# EAGLE design CktoControl (EAGLE 5.11)
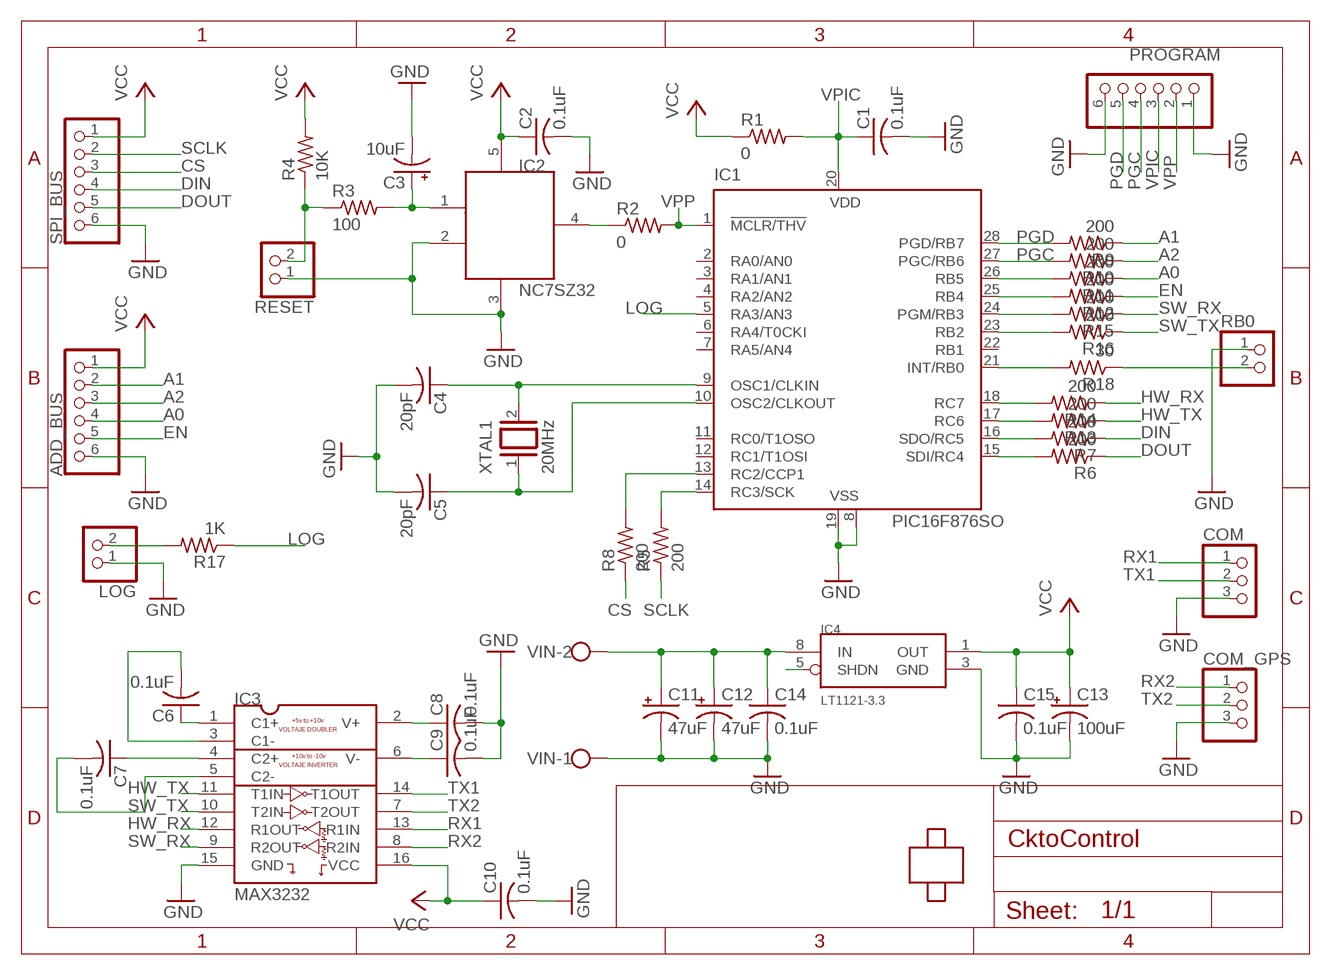
[diagram p0: schematic, sheet 1]

## Parts
ADD_BUS  PINHD-1X6  [1X06]
C1  0.1uF  C-USC0603  [C0603]
C2  0.1uF  C-USC0603  [C0603]
C3  10uF  CPOL-USA/3216-18W  [A/3216-18W]
C4  20pF  C-USC0603  [C0603]
C5  20pF  C-USC0603  [C0603]
C6  0.1uF  C-USC0603  [C0603]
C7  0.1uF  C-USC0603  [C0603]
C8  0.1uF  C-USC0603  [C0603]
C9  0.1uF  C-USC0603  [C0603]
C10  0.1uF  C-USC0603  [C0603]
C11  47uF  CPOL-USE  [PANASONIC_E]
C12  47uF  CPOL-USE  [PANASONIC_E]
C13  100uF  CPOL-USE  [PANASONIC_E]
C14  0.1uF  C-USC0603  [C0603]
C15  0.1uF  C-USC0603  [C0603]
COM  PINHD-1X3/90  [1X03/90]
COM_GPS  PINHD-1X3/90  [1X03/90]
IC1  PIC16F876SO  [SO28W]
IC2  NC7SZ32  NC7S32  [SOT-23-5]
IC3  MAX3232  [SOIC16N]
IC4  LT1121-3.3  [SO08]
LOG  PINHD-1X2/90  [1X02/90]
PROGRAM  PINHD-1X6/90  [1X06/90]
R1  0  R-US_R0603  [R0603]
R2  0  R-US_R0603  [R0603]
R3  100  R-US_R0603  [R0603]
R4  10K  R-US_R0603  [R0603]
R5  200  R-US_R0603  [R0603]
R6  200  R-US_R0603  [R0603]
R7  200  R-US_R0603  [R0603]
R8  200  R-US_R0603  [R0603]
R9  200  R-US_R0603  [R0603]
R10  200  R-US_R0603  [R0603]
R11  200  R-US_R0603  [R0603]
R12  200  R-US_R0603  [R0603]
R13  200  R-US_R0603  [R0603]
R14  200  R-US_R0603  [R0603]
R15  200  R-US_R0603  [R0603]
R16  200  R-US_R0603  [R0603]
R17  1K  R-US_R0603  [R0603]
R18  30  R-US_R0603  [R0603]
RB0  PINHD-1X2  [1X02]
RESET  PINHD-1X2/90  [1X02/90]
SPI_BUS  PINHD-1X6  [1X06]
U$1  BOARD_ADC  [BOARD_ADC]
VIN  W237-102  [W237-102]
XTAL1  20MHz  XTAL  [XTAL]

## Nets
A0: ADD_BUS.4 R11.1
A1: ADD_BUS.2 R9.1
A2: ADD_BUS.3 R10.1
CS: R8.1 SPI_BUS.3
DIN: R7.1 SPI_BUS.4
DOUT: R6.1 SPI_BUS.5
EN: ADD_BUS.5 R12.1
GND: ADD_BUS.6 C1.2 C2.2 C3.- C4.2 C5.2 C8.2 C9.2 C10.2 C11.- C12.- C13.- C14.2 C15.2 COM.3 COM_GPS.3 IC1.8(VSS) IC1.19(VSS) IC2.2(IN2) IC2.3(1_GND) IC3.15(GND) IC4.3(GND) LOG.1 PROGRAM.1 PROGRAM.6 RB0.1 RESET.1 SPI_BUS.6 VIN.1
HW_RX: IC3.12(R1OUT) R14.1
HW_TX: IC3.11(T1IN) R13.1
LOG: IC1.5(RA3/AN3) R17.1
N$5: IC2.4(OUT) R2.1
N$6: C5.1 IC1.10(OSC2/CLKOUT) XTAL1.1
N$7: C3.+ IC2.1(IN1) R3.2
N$8: R3.1 R4.1 RESET.2
N$9: C4.1 IC1.9(OSC1/CLKIN) XTAL1.2
N$10: C6.1 IC3.1(C1+)
N$11: C6.2 IC3.3(C1-)
N$12: C7.1 IC3.4(C2+)
N$13: C7.2 IC3.5(C2-)
N$14: C8.1 IC3.2(V+)
N$15: C9.1 IC3.6(V-)
N$16: IC1.13(RC2/CCP1) R8.2
N$17: IC1.24(PGM/RB3) R15.2
N$18: IC1.14(RC3/SCK) R5.2
N$19: IC1.15(SDI/RC4) R6.2
N$20: IC1.16(SDO/RC5) R7.2
N$21: IC1.23(RB2) R16.2
N$22: IC1.26(RB5) R11.2
N$23: IC1.25(RB4) R12.2
N$24: IC1.18(RC7) R14.2
N$25: IC1.17(RC6) R13.2
N$26: LOG.2 R17.2
N$27: C11.+ C12.+ C14.1 IC4.8(IN) VIN.2
N$28: IC1.21(INT/RB0) R18.2
N$29: R18.1 RB0.2
N$31: IC4.5(SHDN)
PGC: IC1.27(PGC/RB6) PROGRAM.4 R10.2
PGD: IC1.28(PGD/RB7) PROGRAM.5 R9.2
RX1: COM.1 IC3.13(R1IN)
RX2: COM_GPS.1 IC3.8(R2IN)
SCLK: R5.1 SPI_BUS.2
SW_RX: IC3.9(R2OUT) R15.1
SW_TX: IC3.10(T2IN) R16.1
TX1: COM.2 IC3.14(T1OUT)
TX2: COM_GPS.2 IC3.7(T2OUT)
VCC: ADD_BUS.1 C2.1 C10.1 C13.+ C15.1 IC2.5(1_VCC) IC3.16(VCC) IC4.1(OUT) R1.1 R4.2 SPI_BUS.1
VPIC: C1.1 IC1.20(VDD) PROGRAM.3 R1.2
VPP: IC1.1(!MCLR/THV) PROGRAM.2 R2.2
Unconnected: IC1.2(RA0/AN0) IC1.3(RA1/AN1) IC1.4(RA2/AN2) IC1.6(RA4/T0CKI) IC1.7(RA5/AN4) IC1.11(RC0/T1OSO) IC1.12(RC1/T1OSI) IC1.22(RB1)

## Library data of the parts
ADD_BUS PROGRAM SPI_BUS = pinhead:PINHD-1X6: PIN HEADER
C1 C2 C4-C10 C14 C15 = rcl:C-US: CAPACITOR, American symbol
C3 C11-C13 = rcl:CPOL-US: POLARIZED CAPACITOR, American symbol
COM COM_GPS = pinhead:PINHD-1X3: PIN HEADER
IC1 = microchip:PIC16*876: MICROCONTROLLER flash type; MF: MICROCHIP; MPN: PIC16F876-20/SO; OC_FARNELL: 9761268; OC_NEWARK: 12C1950
IC2 = magnetometro:NC7S32
IC3 = Ricardo_Library:MAX3232
IC4 = Ricardo_Library:LT1121-3.3
LOG RB0 RESET = pinhead:PINHD-1X2: PIN HEADER
R1-R18 = rcl:R-US_: RESISTOR, American symbol
U$1 = magnetometro:BOARD_ADC
VIN = con-wago-500:W237-102: WAGO SCREW CLAMP; MPN: 237-102; OC_FARNELL: unknown; OC_NEWARK: 70K9898
XTAL1 = Ricardo_Library:XTAL

## Board
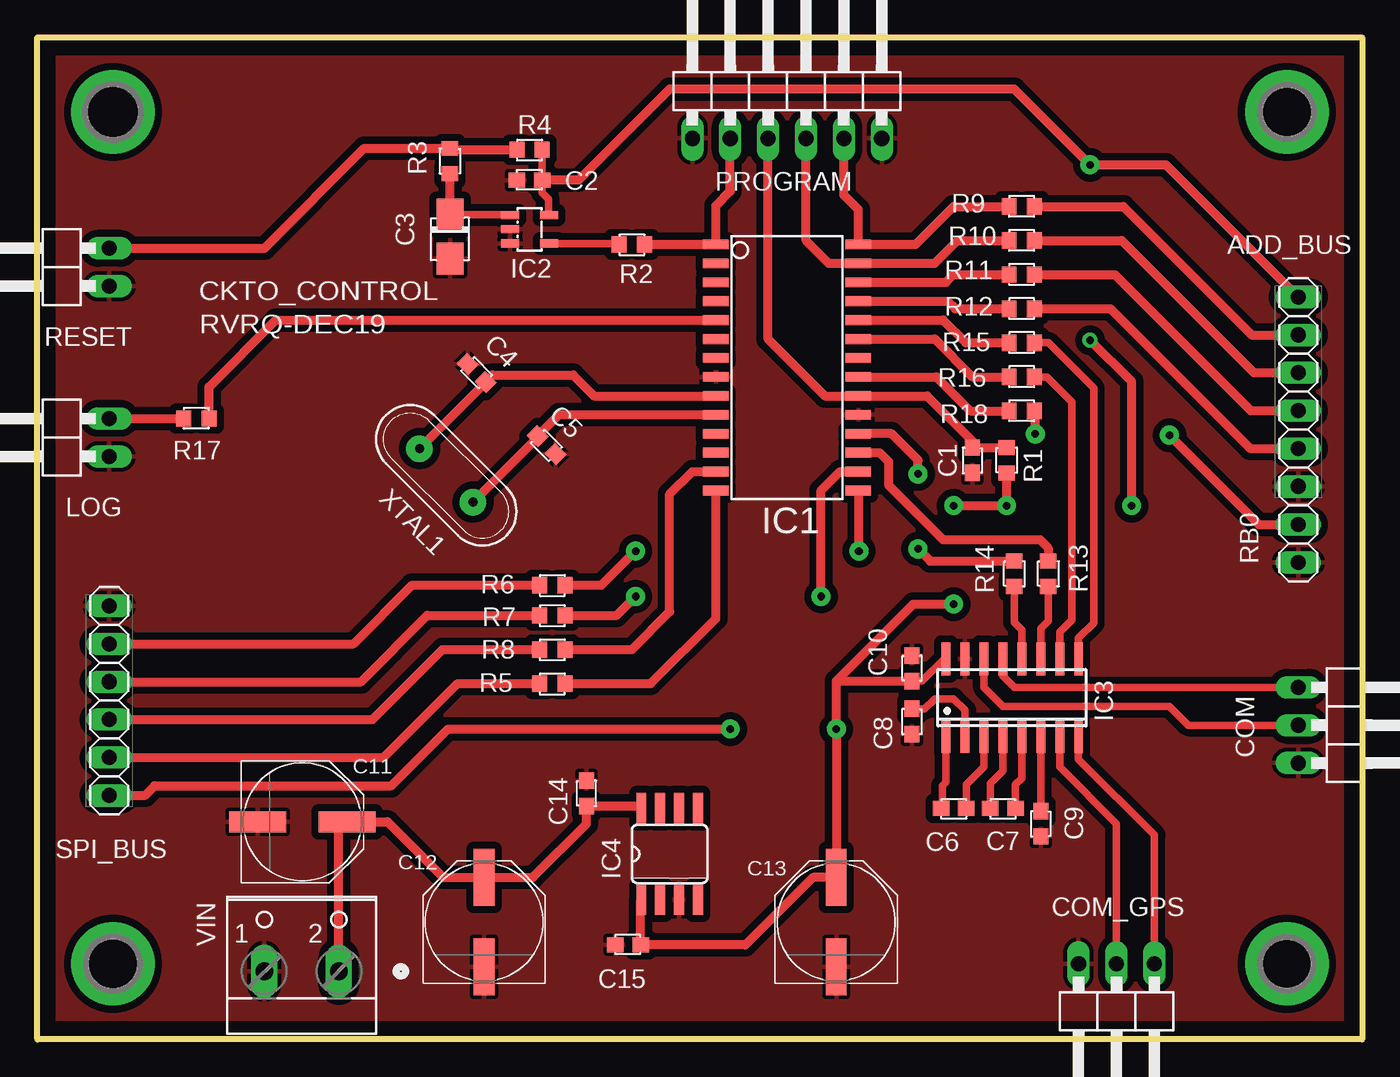
[diagram p1: board, top side]
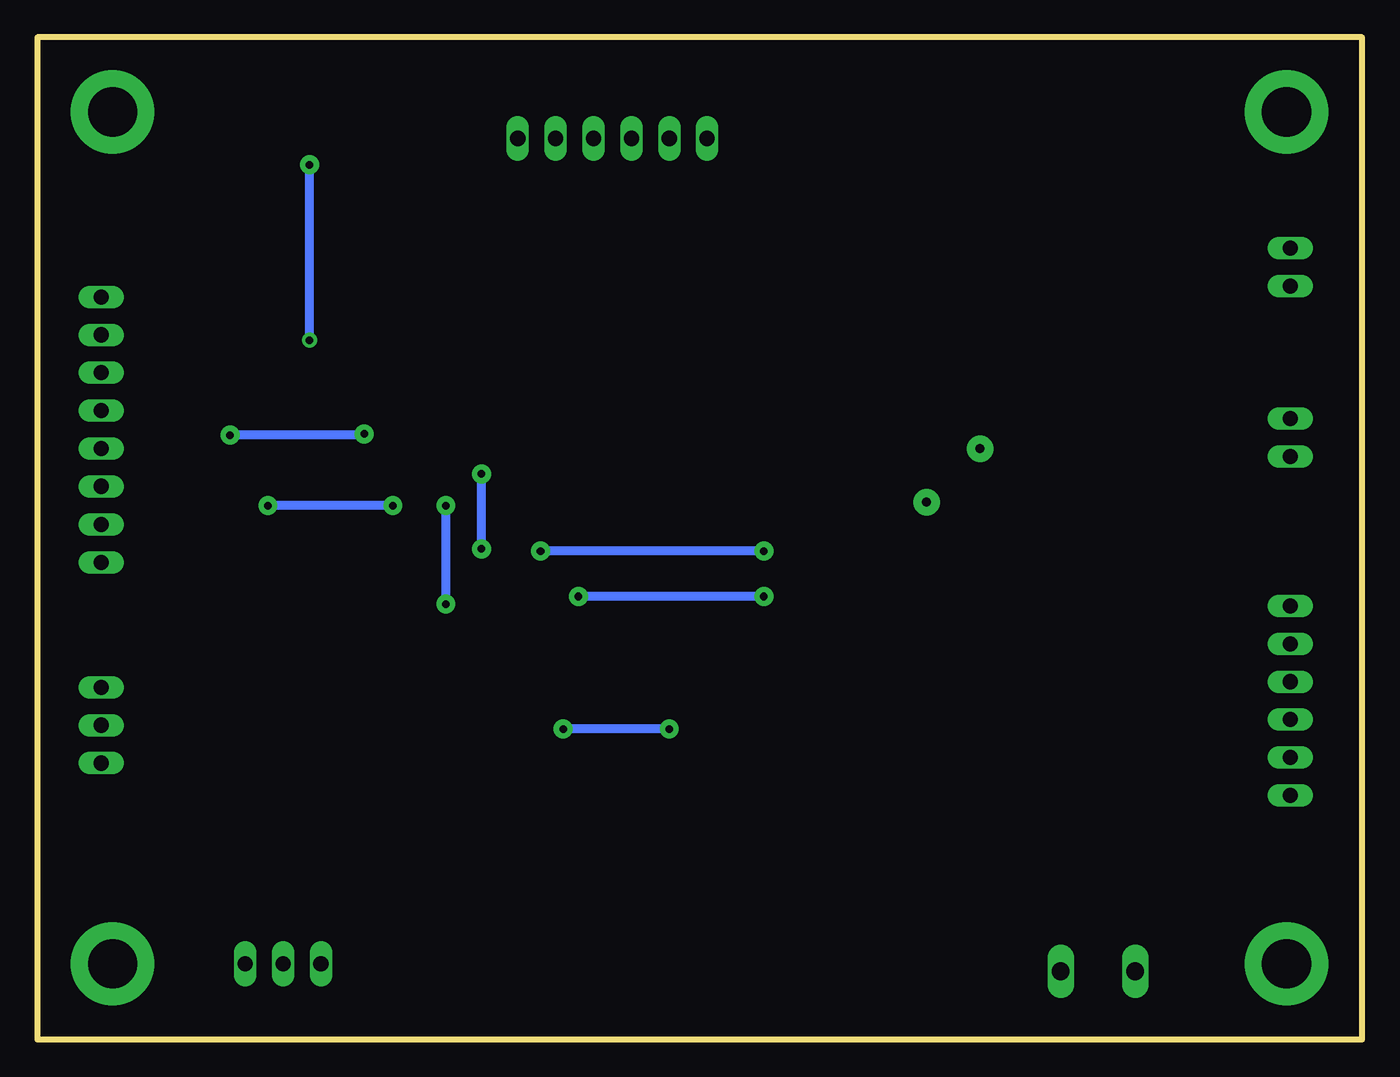
[diagram p2: board, bottom side, seen from below]

Size 88.87 x 67.23 mm. Coordinates in mm from the lower left corner, seen from the top.
Outline: 0,67.23 88.88,67.23 88.88,0 0,0 0,67.23
Copper layers (1*16): Top 0.035mm / dielectric 1.5mm / Bottom 0.035mm
Design rules "default": minimum track width 10mil, minimum drill 24mil, track to track 8mil, track to pad 8mil, pad to pad 8mil, via to via 8mil, smd to smd 8mil, copper to edge 40mil, drill to drill 8mil, minimum pad ring 10mil, minimum via ring 8mil, stop-mask expansion 4mil, vias tented up to drill 0mil, thermal gap 10mil

### Footprints (pad centres in the part's own frame; a part is rotated, then mirrored left to right if it is on the bottom)
1X06 = drill 1.016 long: 1 -6.35,0; 2 -3.81,0; 3 -1.27,0; 4 1.27,0; 5 3.81,0; 6 6.35,0
C0603 = smd 1.1 x 1: 1 -0.85,0; 2 0.85,0
A/3216-18W = smd 2.15 x 1.8: + 1.475,0; - -1.475,0
PANASONIC_E = smd 3.8 x 1.4: + 3,0; - -3,0
1X03/90 = drill 1.016 long: 1 -2.54,-3.81; 2 0,-3.81; 3 2.54,-3.81
SO28W = smd 0.65 x 1.7: 1 -7.62,-4.78; 2 -6.35,-4.78; 3 -5.08,-4.78; 4 -3.81,-4.78; 5 -2.54,-4.78; 6 -1.27,-4.78; 7 0,-4.78; 8 1.27,-4.78; 9 2.54,-4.78; 10 3.81,-4.78; 11 5.08,-4.78; 12 6.35,-4.78; 13 7.62,-4.78; 14 8.89,-4.78; 15 8.89,4.78; 16 7.62,4.78; 17 6.35,4.78; 18 5.08,4.78; 19 3.81,4.78; 20 2.54,4.78; 21 1.27,4.78; 22 0,4.78; 23 -1.27,4.78; 24 -2.54,4.78; 25 -3.81,4.78; 26 -5.08,4.78; 27 -6.35,4.78; 28 -7.62,4.78
SOT-23-5 = smd 1.2 x 0.55: 1 1.3,-0.95; 2 1.3,0; 3 1.3,0.95; 4 -1.3,0.95; 5 -1.3,-0.95
SOIC16N = smd 0.6 x 2.2: 1 -3.302,-3.032; 2 -2.032,-3.032; 3 -0.762,-3.032; 4 0.508,-3.032; 5 1.778,-3.032; 6 3.048,-3.032; 7 4.318,-3.032; 8 5.588,-3.032; 9 5.588,2.168; 10 4.318,2.168; 11 3.048,2.168; 12 1.778,2.168; 13 0.508,2.168; 14 -0.762,2.168; 15 -2.032,2.168; 16 -3.302,2.168
SO08 = smd 0.66 x 2.032: 1 -1.905,-3.073; 2 -0.635,-3.073; 3 0.635,-3.073; 4 1.905,-3.073; 5 1.905,3.073; 6 0.635,3.073; 7 -0.635,3.073; 8 -1.905,3.073
1X02/90 = drill 1.016 long: 1 -1.27,-3.81; 2 1.27,-3.81
1X06/90 = drill 1.016 long: 1 -6.35,-3.81; 2 -3.81,-3.81; 3 -1.27,-3.81; 4 1.27,-3.81; 5 3.81,-3.81; 6 6.35,-3.81
R0603 = smd 1 x 1.1: 1 -0.85,0; 2 0.85,0
1X02 = drill 1.016 long: 1 -1.27,0; 2 1.27,0
W237-102 = drill 1.194 long: 1 -2.5,-1.27; 2 2.5,-1.27
XTAL = drill 0.61 pad 1.778 round: 1 -2.54,0; 2 2.54,0

### Placement (x,y rotation side)
ADD_BUS  84.58,43.46 270 top
C1  62.74,38.86 270 top
C2  33.02,57.66 180 top
C3  27.69,53.85 90 top
C4  29.46,44.7 135 top
C5  34.16,39.88 315 top
C6  61.47,15.49 0 top
C7  64.77,15.49 0 top
C8  58.67,21.34 270 top
C9  67.31,14.48 270 top
C10  58.67,24.89 90 top
C11  17.78,14.61 0 top
C12  29.97,7.87 90 top
C13  53.59,7.87 90 top
C14  36.83,16.51 90 top
C15  39.62,6.35 180 top
COM  88.39,21.08 270 top
COM_GPS  72.39,1.27 180 top
IC1  50.29,45.72 270 top
IC2  33.02,54.36 180 top
IC3  64.26,23.37 0 top
IC4  42.42,12.45 0 top
LOG  1.02,40.39 90 top
PROGRAM  50.29,64.26 0 top
R1  65.02,38.86 90 top
R2  39.88,53.34 0 top
R3  27.69,58.93 270 top
R4  33.02,59.69 0 top
R5  34.54,23.88 0 top
R6  34.54,30.48 0 top
R7  34.54,28.45 0 top
R8  34.54,26.16 0 top
R9  66.04,55.88 180 top
R10  66.04,53.59 180 top
R11  66.04,51.31 180 top
R12  66.04,49.02 180 top
R13  67.82,31.24 90 top
R14  65.53,31.24 90 top
R15  66.04,46.74 180 top
R16  66.04,44.45 180 top
R17  10.67,41.66 180 top
R18  66.04,42.16 180 top
RB0  84.58,33.27 90 top
RESET  1.02,51.82 90 top
SPI_BUS  4.83,22.73 90 top
U$1  1.65,1.8 0 top
VIN  17.73,5.84 0 top
XTAL1  27.43,37.85 135 top

### Tracks (layer width: path | path; a pad name or v marks a point on that pad's centre or on a via)
A0
  Top 0.61: R11.1 72.29,51.31 81.41,42.19 ADD_BUS.4
A1
  Top 0.61: R9.1 72.85,55.88 81.46,47.27 ADD_BUS.2
A2
  Top 0.61: R10.1 72.75,53.59 81.61,44.73 ADD_BUS.3
CS
  Top 0.61: SPI_BUS.3 22.48,21.46 27.18,26.16 R8.1
DIN
  Top 0.61: SPI_BUS.4 21.72,24 26.16,28.45 R7.1
DOUT
  Top 0.61: SPI_BUS.5 21.21,26.54 25.15,30.48 R6.1
EN
  Top 0.61: R12.1 71.98,49.02 81.36,39.65 ADD_BUS.5
GND
  pour Top (isolate 0.483): 0,67.31 88.9,67.31 88.9,0 0,0
HW_RX
  Top 0.508: R14.1 65.53,27.99 66.04,27.48 IC3.12
HW_TX
  Top 0.508: R13.1 67.82,28.09 67.31,27.58 IC3.11
LOG
  Top 0.61: IC1.5 16,48.26 11.52,43.78 R17.1
N$1  (via drill 3.3 pad 5.59)
  other vias: 5.08,62.23
N$2  (via drill 3.3 pad 5.59)
  other vias: 5.08,5.08
N$3  (via drill 3.3 pad 5.59)
  other vias: 83.82,5.08
N$4  (via drill 3.3 pad 5.59)
  other vias: 83.82,62.23
N$5
  Top 0.508: R2.1 38.96,53.41 IC2.4
N$6
  Top 0.61: XTAL1.1 33.56,40.38 C5.1 34.99,41.91 IC1.10
N$7
  Top 0.508: IC2.1 31.7,55.32 C3.+
  Top 0.61: C3.+ R3.2
N$8
  Top 0.61: RESET.2 15.24,53.09 21.93,59.78 R3.1 27.77,59.69 R4.1
N$9
  Top 0.61: IC1.9 37.34,43.18 35.94,44.58 30.54,44.58 C4.1 30.07,44.07 XTAL1.2
N$10
  Top 0.508: IC3.1 60.96,17.27 60.71,17.02 60.71,15.58 C6.1
N$11
  Top 0.508: C6.2 62.32,17.11 63.5,18.29 IC3.3
N$12
  Top 0.508: C7.1 63.92,17.18 64.77,18.03 IC3.4
N$13
  Top 0.508: C7.2 65.62,17.11 66.04,17.53 IC3.5
N$14
  Top 0.508: C8.1 59.52,22.19 60.2,22.86 61.47,22.86 62.23,22.1 IC3.2
N$15
  Top 0.508: C9.1 IC3.6
N$16
  Top 0.61: R8.2 39.88,26.16 42.42,28.7 42.42,36.58 43.94,38.1 IC1.13
N$17
  Top 0.61: IC1.24 60.76,48.26 62.28,46.74 R15.2
N$18
  Top 0.61: R5.2 41.15,23.88 45.51,28.24 IC1.14
N$19  (via drill 0.51 pad 1.27)
  Top 0.61: R6.2 37.85,30.48 v40.13,32.77 | IC1.15 55.12,36.78 v55.12,32.77
  Bottom 0.61: v40.13,32.77 v55.12,32.77
N$20  (via drill 0.51 pad 1.27)
  Top 0.61: R7.2 38.86,28.45 v40.13,29.72 | v52.58,29.72 52.58,36.83 53.85,38.1 IC1.16
  Bottom 0.61: v40.13,29.72 v52.58,29.72
N$21
  Top 0.61: IC1.23 60.2,46.99 62.74,44.45 R16.2
N$22
  Top 0.61: IC1.26 60.96,50.8 61.47,51.31 R11.2
N$23
  Top 0.61: IC1.25 61.06,49.53 61.57,49.02 R12.2
N$24  (via drill 0.51 pad 1.27)
  Top 0.61: IC1.18 57.3,40.64 59.08,38.86 v59.08,37.95 | v59.08,32.92 59.91,32.09 R14.2
  Bottom 0.61: v59.08,32.92 v59.08,37.95
N$25
  Top 0.61: R13.2 67.82,32.97 67.26,33.53 60.76,33.53 57.1,37.19 57.1,38.76 56.49,39.37 IC1.17
N$26
  Top 0.61: LOG.2 R17.2
N$27
  Top 0.61: IC4.8 40.37,15.66 C14.1 36.83,14.48 33.23,10.87 C12.+ 27.23,10.87 23.5,14.61 C11.+ 20.23,14.61 VIN.2
N$28
  Top 0.61: IC1.21 60.3,44.45 62.59,42.16 R18.2
N$29  (via drill 0.51 pad 1.27)
  Top 0.61: v75.95,40.54 81.94,34.54 RB0.2 | R18.1 66.94,42.11 v66.94,40.63
  Bottom 0.61: v66.94,40.63 67.03,40.54 v75.95,40.54
PGC
  Top 0.61: R10.2 61.72,53.59 60.2,52.07 IC1.27 53.09,52.07 51.56,53.59 PROGRAM.4
PGD
  Top 0.61: R9.2 61.47,55.88 58.93,53.34 IC1.28 55.07,55.67 54.1,56.64 PROGRAM.5
RX1
  Top 0.508: IC3.13 64.77,24.38 65.53,23.62 COM.1
RX2
  Top 0.508: IC3.8 69.85,18.8 74.93,13.72 COM_GPS.1
SCLK
  Top 0.61: SPI_BUS.2 23.24,18.92 28.19,23.88 R5.1
SW_RX
  Top 0.508: R15.1 67.82,46.74 70.87,43.69 70.87,27.94 69.85,26.92 IC3.9
SW_TX
  Top 0.508: IC3.10 68.58,27.33 69.39,28.14 69.39,42.77 67.72,44.45 R16.1
TX1
  Top 0.508: IC3.14 63.5,23.62 64.77,22.35 75.95,22.35 77.22,21.08 COM.2
TX2
  Top 0.508: IC3.7 68.58,18.29 72.39,14.48 COM_GPS.2
VCC  (via drill 0.51 pad 1.02, 0.51 pad 1.27)
  Top 0.508: C10.1 59.35,24.04 60.84,25.54 IC3.16 | IC2.5 34.29,55.34 34.29,56.39 33.87,56.81 C2.1 R4.2
  Top 0.61: 53.59,24.04 C10.1 | IC4.1 40.47,9.33 C15.1 47.5,6.35 52.02,10.87 C13.+ v53.59,20.83 53.59,24.04 | ADD_BUS.1 75.72,58.67 v70.61,58.67 65.53,63.75 42.42,63.75 36.32,57.66 C2.1 | R1.1 v65.02,35.81 v61.47,35.81 | v61.47,29.21 58.76,29.21 53.59,24.04 | SPI_BUS.1 7.24,16.38 7.87,17.02 23.75,17.02 27.56,20.83 v46.48,20.83 | v70.61,46.91 73.41,44.12 v73.41,35.81
  Bottom 0.61: v61.47,29.21 v61.47,35.81 | v70.61,46.91 v70.61,58.67 | v65.02,35.81 v73.41,35.81 | v46.48,20.83 v53.59,20.83
VPIC
  Top 0.61: R1.2 C1.1 62.74,40.13 59.69,43.18 IC1.20 52.83,43.18 49.02,46.99 PROGRAM.3
VPP
  Top 0.61: R2.2 IC1.1 45.51,55.93 46.48,56.9 PROGRAM.2

### Text on the board
tPlace: CKTO_CONTROL | RVRQ-DEC19